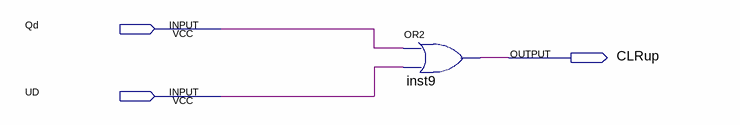
[diagram p0: schematic sheet]
// Quartus schematic CLRup.bdf as structural Verilog: 1 symbols, 3 pins
module CLRup (
  input  Qd,
  input  UD,
  output CLRup
);

  or inst9 (CLRup, Qd, UD);
endmodule
